# EAGLE schematic transmitter_lify (EAGLE 7.6.0)
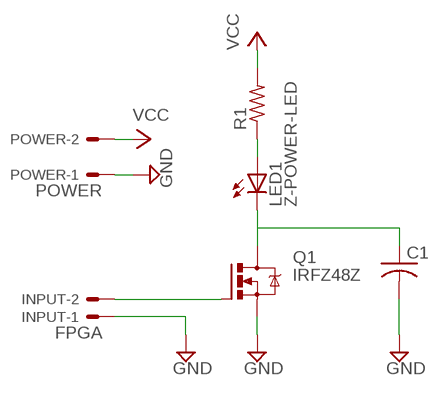
[diagram p0: schematic, sheet 1]

## Parts
C1  C-US050-030X075  [C050-030X075]
INPUT  FPGA  22-23-2021  [22-23-2021]
LED1  Z-POWER-LED  [Z-POWER-LED-PCB-TYPE]
POWER  POWER  22-23-2021  [22-23-2021]
Q1  IRFZ48Z  [TO220BH]
R1  R-US_0411/12  [0411/12]

## Nets
GND: C1.2 INPUT.1 POWER.1 Q1.S
N$1: C1.1 LED1.C Q1.D
N$2: LED1.A R1.1
N$3: INPUT.2 Q1.G
VCC: POWER.2 R1.2

## Library data of the parts
C1 = rcl:C-US: CAPACITOR, American symbol
INPUT POWER = con-molex:22-23-2021: .100" (2.54mm) Center Header - 2 Pin; MF: MOLEX; MPN: 22-23-2021; OC_FARNELL: 1462926; OC_NEWARK: 25C3832
LED1 = led:Z-POWER-LED: Z-Power LED Source: http://www.seoulsemicon.co.kr .. X42182.pdf
Q1 = transistor-power:IRFZ48: N Channel HEXFET® Power MOSFET Logic Level Source: http://www.irf.com/product-info/datasheets/data/irfz48z.pdf
R1 = rcl:R-US_: RESISTOR, American symbol